# Altium schematic sheet MCU schematic.SchDoc
size A3; SheetNumber: 2; SheetTotal: 5
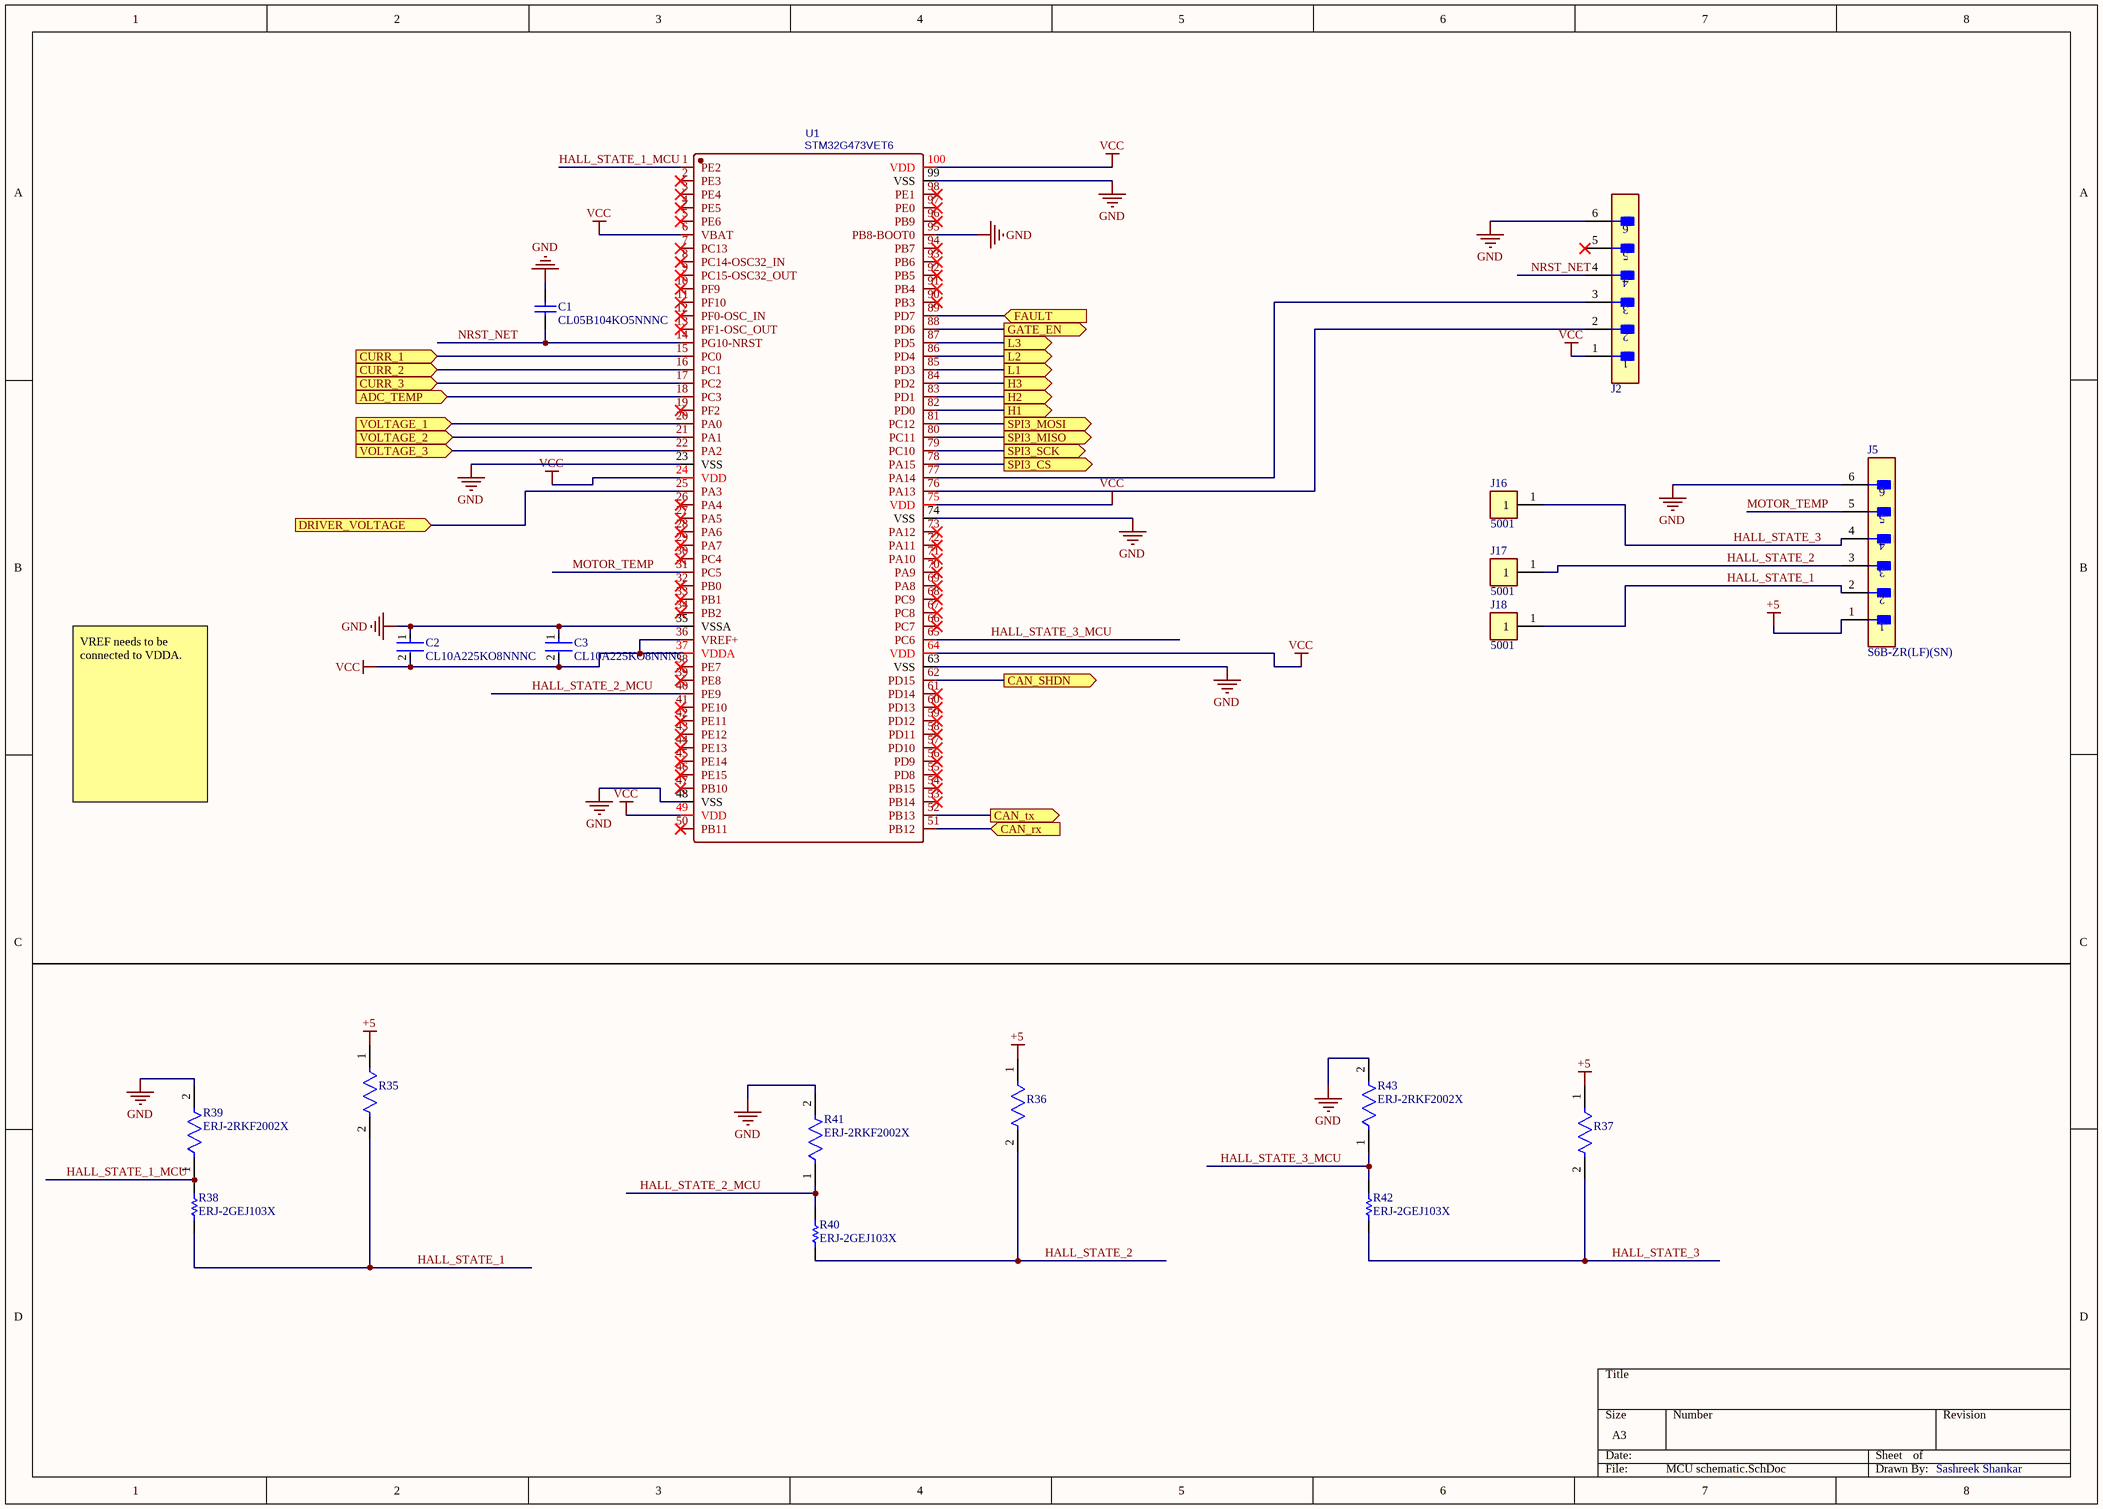
[diagram p0: MCU schematic.SchDoc]

## Parts
C1  CL05B104KO5NNNC  [CAPC1050X55X23ML05T13]
C2  CL10A225KO8NNNC  [FP-CL10-IPC_A]
C3  CL10A225KO8NNNC  [FP-CL10-IPC_A]
J2  S6B-ZR(LF)(SN)  [FP-S6B-ZR_LF_SN-MFG]  (value not drawn)
J5  S6B-ZR(LF)(SN)  [FP-S6B-ZR_LF_SN-MFG]
J16  5001  [FP-5001-MFG]
J17  5001  [FP-5001-MFG]
J18  5001  [FP-5001-MFG]
R35  ERA-2AEB332X  [FP-ERA2A-MFG]  (value not drawn)
R36  ERA-2AEB332X  [FP-ERA2A-MFG]  (value not drawn)
R37  ERA-2AEB332X  [FP-ERA2A-MFG]  (value not drawn)
R38  ERJ-2GEJ103X  [RESC1005X40X25ML05T05]
R39  ERJ-2RKF2002X  [FP-ERJ2RK-MFG]
R40  ERJ-2GEJ103X  [RESC1005X40X25ML05T05]
R41  ERJ-2RKF2002X  [FP-ERJ2RK-MFG]
R42  ERJ-2GEJ103X  [RESC1005X40X25ML05T05]
R43  ERJ-2RKF2002X  [FP-ERJ2RK-MFG]
U1  STM32G473VET6  [MCU-LQFP100]

## Ports
ADC_TEMP (in), CAN_rx (in), CAN_SHDN (out), CAN_tx (out), CURR_1 (in), CURR_2 (in), CURR_3 (in), DRIVER_VOLTAGE (in), FAULT (in), GATE_EN (out), H1 (out), H2 (out), H3 (out), L1 (out), L2 (out), L3 (out), SPI3_CS (out), SPI3_MISO (out), SPI3_MOSI (out), SPI3_SCK (out), VOLTAGE_1 (in), VOLTAGE_2 (in), VOLTAGE_3 (in)

## Nets
+5: J5.1 R35.1 R36.1 R37.1
GND: C1.2 C2.1 C3.1 J2.6 J5.6 R39.2 R41.2 R43.2 U1.23(VSS) U1.35(VSSA) U1.48(VSS) U1.63(VSS) U1.74(VSS) U1.95(PB8-BOOT0) U1.99(VSS)
VCC: C2.2 C3.2 J2.1 U1.6(VBAT) U1.24(VDD) U1.36(VREF+) U1.37(VDDA) U1.49(VDD) U1.64(VDD) U1.75(VDD) U1.100(VDD)
ADC_TEMP: U1.18(PC3) ; port ADC_TEMP
CAN_rx: U1.51(PB12) ; port CAN_rx
CAN_SHDN: U1.62(PD15) ; port CAN_SHDN
CAN_tx: U1.52(PB13) ; port CAN_tx
CURR_1: U1.15(PC0) ; port CURR_1
CURR_2: U1.16(PC1) ; port CURR_2
CURR_3: U1.17(PC2) ; port CURR_3
DRIVER_VOLTAGE: U1.25(PA3) ; port DRIVER_VOLTAGE
FAULT: U1.89(PD7) ; port FAULT
GATE_EN: U1.88(PD6) ; port GATE_EN
H1: U1.82(PD0) ; port H1
H2: U1.83(PD1) ; port H2
H3: U1.84(PD2) ; port H3
HALL_STATE_1: J5.2 J18.1 R35.2 R38.1
HALL_STATE_1_MCU: R38.2 R39.1 U1.1(PE2)
HALL_STATE_2: J5.3 J17.1 R36.2 R40.1
HALL_STATE_2_MCU: R40.2 R41.1 U1.40(PE9)
HALL_STATE_3: J5.4 J16.1 R37.2 R42.1
HALL_STATE_3_MCU: R42.2 R43.1 U1.65(PC6)
L1: U1.85(PD3) ; port L1
L2: U1.86(PD4) ; port L2
L3: U1.87(PD5) ; port L3
MOTOR_TEMP: J5.5 U1.31(PC5)
NRST_NET: C1.1 J2.4 U1.14(PG10-NRST)
SPI3_CS: U1.78(PA15) ; port SPI3_CS
SPI3_MISO: U1.80(PC11) ; port SPI3_MISO
SPI3_MOSI: U1.81(PC12) ; port SPI3_MOSI
SPI3_SCK: U1.79(PC10) ; port SPI3_SCK
VOLTAGE_1: U1.20(PA0) ; port VOLTAGE_1
VOLTAGE_2: U1.21(PA1) ; port VOLTAGE_2
VOLTAGE_3: U1.22(PA2) ; port VOLTAGE_3
NetJ2_2: J2.2 U1.76(PA13)
NetJ2_3: J2.3 U1.77(PA14)

Not connected (* = marked no-connect by the designer): J2 5*; U1 2(PE3)* 3(PE4)* 4(PE5)* 5(PE6)* 7(PC13)* 8(PC14-OSC32_IN)* 9(PC15-OSC32_OUT)* 10(PF9)* 11(PF10)* 12(PF0-OSC_IN)* 13(PF1-OSC_OUT)* 19(PF2)* 26(PA4)* 27(PA5)* 28(PA6)* 29(PA7)* 30(PC4)* 32(PB0)* 33(PB1)* 34(PB2)* 38(PE7)* 39(PE8)* 41(PE10)* 42(PE11)* 43(PE12)* 44(PE13)* 45(PE14)* 46(PE15)* 47(PB10)* 50(PB11)* 53(PB14)* 54(PB15)* 55(PD8)* 56(PD9)* 57(PD10)* 58(PD11)* 59(PD12)* 60(PD13)* 61(PD14)* 66(PC7)* 67(PC8)* 68(PC9)* 69(PA8)* 70(PA9)* 71(PA10)* 72(PA11)* 73(PA12)* 90(PB3)* 91(PB4)* 92(PB5)* 93(PB6)* 94(PB7)* 96(PB9)* 97(PE0)* 98(PE1)*

## Notes on the sheet
- VREF needs to be connected to VDDA.
- Sashreek Shankar

## Library data of the parts
C1 = CMP-2000-05439-1: Chip Capacitor, 100 nF, +/- 10%, 16 V, -55 to 125 degC, 0402 (1005 Metric), RoHS, Tape and Reel; Manufacturer: Samsung Electro-Mechanics; Capacitance: 100000pF; Dielectric: X7R; Rated Voltage: 16V; Case Size/Dimension: 0402; Tolerance (%): ±10%; Manufacturer URL: http://www.samsungsem.com/global/index.jsp; Datasheet URL: https://datasheet.ciiva.com/29198/458718-da-01-en-vs-kondensator-0402-29198423.pdf; Datasheet Version: Nov-10
C2 C3 = CMP-13271-000835-1: Cap Ceramic 2.2uF 16V X5R ±10% Pad SMD 0603 +85°C T/R; Case Code (Metric): 1608; Height: 0.8mm; Case/Package: 0603; Depth: 0.8mm; Capacitance: 2.2uF; Voltage Rating: 16V; Case Code (Imperial): 0603; Length: 1.6mm; Packaging: Tape and Reel; Material: Ceramic; Lead Free: Lead Free; Max Operating Temperature: 85°C; Contact Plating: Tin; Thickness: 0.035inch; Radiation Hardening: No; Tolerance: 10%; Min Operating Temperature: -55°C; Voltage: 16V; Dielectric: X5R; Mount: Surface Mount; Package Quantity: 4000; Width: 0.031inch; Voltage Rating (DC): 16V
J2 J5 = CMP-17439-000122-1: CONN HEADER R/A 6POS 1.5MM; Body Plating: Tin; Contact Resistance: 30mR; Voltage Rating (DC): 50V; Number of Positions: 6; Current Rating: 1A; Panel Thickness: 3.5mm; Insulation Resistance: 500MR; Gender: Male; Lead Free: Lead Free; Contact Shape: Circular; Material: Nylon; Number of Rows: 1; Fastening Type: Detent; Number of Pins: 6; Color: White; Flammability Rating: UL94 V-0; Series: ZH; Depth: 6mm; Termination: Solder; Length: 10.5mm; Lead Pitch: 1.5mm; Min Operating Temperature: -25°C; Width: 3.5mm; Max Operating Temperature: 85°C; Contact Material: Brass; Packaging: Bulk; Insulation Material: Nylon; Height: 7.2mm; Voltage Rating: 50V; Mount: Through Hole; Contact Mating Length: 0.094inch; Max Current Rating: 1A; Insulation Color: Natural; Voltage Rating (AC): 50V; Contact Type: Male Pin; Contact Finish - Mating: TIN; Pitch: 1.5mm; Number of Contacts: 6; Housing Color: Beige; REACH SVHC: No SVHC; Connector Type: Header; Orientation: Right Angle; Max Voltage Rating (AC): 50V; Housing Material: Polyamide; Contact Plating: Tin
J16-J18 = CMP-2000-05181-2: PC TEST POINT MINIATURE BLACK; Body Material: Bronze; Plating: Silver; Inside Diameter: 1.27mm; Hole Diameter: 1.6mm; Number of Ports: 1; Outside Diameter: 2.54mm; Insulation: Insulated; Insulation Material: Nylon; Mount: Through Hole; RoHS Compliant: Yes; Series: THM; Height: 0.3inch; Termination: Through Hole; Material: Nylon; Packaging: Bulk; Contact Material: Bronze; REACH SVHC: No SVHC; Contact Plating: Silver; Orientation: Straight; Lead Free: Lead Free; Package Quantity: 100; Length: 7.62mm; Flammability Rating: UL94 V-0; Number of Contacts: 1; Diameter: 2.54mm; Housing Color: Black; Color: Black
R35-R37 = CMP-2002-05884-2: NexarPartId: 9251384; Voltage Rating (DC): 25V; Temperature Coefficient: 25ppm/°C; Tolerance: 0.1%; Resistance: 3.3kΩ; Power Rating: 63mW; Case/Package: 0402; Number of Terminations: 2; Military Standard: Not; Case Code (Imperial): 0402; Length: 1mm; Contact Plating: Tin; Termination: SMD/SMT; Schedule B: 8533210045, 8533210045; Voltage Rating: 25V; Lead Free: Lead Free; Min Operating Temperature: -55°C; REACH SVHC: No SVHC; Max Power Dissipation: 63mW; Weight: 793.786648µg; RoHS: Compliant; Depth: 500µm; Packaging: Cut Tape; Max Operating Temperature: 155°C; Width: 500µm; Case Code (Metric): 1005; Height: 350µm; Composition: Thin Film; Lifecycle Status: Production; Radiation Hardening: No; Number of Pins: 2; Mount: Surface Mount
R38 R40 R42 = CMP-2002-00433-1: Manufacturer: Panasonic; Part Number: ERJ-2GEJ103X
R39 R41 R43 = CMP-2002-00759-4: RES SMD 20K OHM 1% 1/10W 0402; Resistance: 20kR; Voltage Rating (DC): 50V; Power Rating: 100mW; Temperature Coefficient: 100ppm/°C; Radiation Hardening: No; Case/Package: 0402; Case Code (Metric): 1005; Min Operating Temperature: -55°C; Termination: SMD/SMT; Package Quantity: 1; Length: 1mm; Case Code (Imperial): 0402; Lead Free: Lead Free; Height: 0.35mm; Max Operating Temperature: 155°C; Depth: 0.5mm; Number of Terminations: 2; Military Standard: Not; Max Power Dissipation: 100mW; Tolerance: 1%; Composition: Thick Film; Weight: 2.8E-05oz; Features: Automotive AEC-Q200; Voltage Rating: 50V; Contact Plating: Tin; REACH SVHC: No SVHC; Width: 0.02inch; Packaging: Cut Tape; Mount: Surface Mount
U1 = STM32G473VET6: BOM_Manufacturer: ST(意法半导体); Contributor: LCSC; BOM_Supplier: LCSC; BOM_Supplier Part: C730122; BOM_Manufacturer Part: STM32G473VET6; BOM_JLCPCB Part Class: Extended Part; spicePre: U; spiceSymbolName: STM32G473VET6